# EAGLE design youth (EAGLE 4.16)
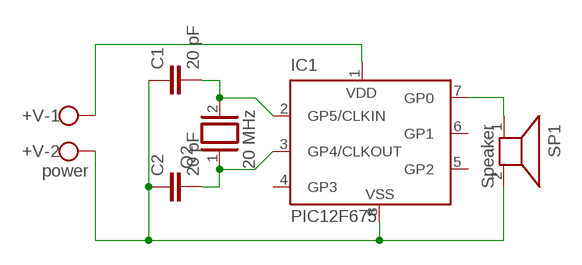
[diagram p0: schematic, sheet 1]

## Parts
+V  power  W237-102  [W237-102]
C1  20 pF  C7.5/3  [C7.5B3]
C2  20 pF  C7.5/3  [C7.5B3]
IC1  PIC12F675  PIC12F675P  [DIL8]
Q2  20 MHz  XTAL/S  [QS]
SP1  Speaker  AL201P  [AL201P]

## Nets
N$1: C1.2 IC1.2(GP5/CLKIN) Q2.2
N$2: C2.2 IC1.3(GP4/CLKOUT) Q2.1
N$3: +V.1 IC1.1(VDD)
N$5: IC1.7(GP0) SP1.1
N$6: +V.2 C1.1 C2.1 IC1.8(VSS) SP1.2
Unconnected: IC1.4(GP3) IC1.5(GP2) IC1.6(GP1)

## Library data of the parts
+V = bert:W237-102: WAGO SCREW CLAMP
C1 C2 = capacitor-wima:C: CAPACITOR naming: grid - package width
IC1 = microchip:PIC12F6*: Data Sheet 8-Pin FLASH-Based 8-Bit CMOS Microcontrollers Source: http://www.microchip.com .. 41190c.pdf
Q2 = special:XTAL/S: CRYSTAL
SP1 = buzzer:AL201P: SPEAKER Source: Buerklin

## Board
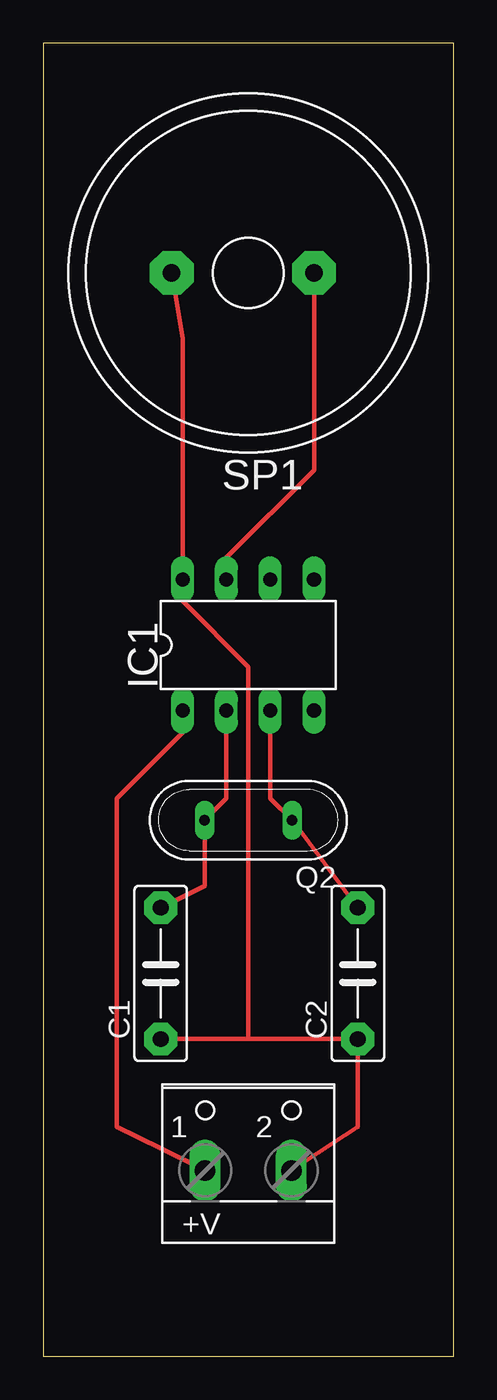
[diagram p1: board, top side]

Size 23.8 x 76.19 mm. Coordinates in mm from the lower left corner, seen from the top.
Outline: 0,0 23.8,0 23.8,76.19 0,76.19 0,0
Copper layers (1*16): Top 0.035mm / dielectric 1.5mm / Bottom 0.035mm
Design rules "default": minimum track width 10mil, minimum drill 24mil, track to track 8mil, track to pad 8mil, pad to pad 8mil, via to via 8mil, smd to smd 8mil, copper to edge 40mil, drill to drill 8mil, minimum pad ring 10mil, minimum via ring 8mil, stop-mask expansion 4mil, vias tented up to drill 0mil, thermal gap 10mil

### Footprints (pad centres in the part's own frame; a part is rotated, then mirrored left to right if it is on the bottom)
W237-102 = drill 1.194 long: 1 -2.5,-1.27; 2 2.5,-1.27
C7.5B3 = drill 0.914 pad 1.905 octagon: 1 -3.81,0; 2 3.81,0
DIL8 = drill 0.813 long: 1 -3.81,-3.81; 2 -1.27,-3.81; 3 1.27,-3.81; 4 3.81,-3.81; 5 3.81,3.81; 6 1.27,3.81; 7 -1.27,3.81; 8 -3.81,3.81
QS = drill 0.61 long: 1 -2.54,0; 2 2.54,0
AL201P = drill 1.016 pad 2.54 octagon: 1 -3.81,0; 2 4.445,0

### Placement (x,y rotation side)
+V  11.9,12.06 0 top
C1  6.82,22.22 90 top
C2  18.25,22.22 90 top
IC1  11.9,41.27 0 top
Q2  11.9,31.11 180 top
SP1  11.9,62.86 180 top

### Tracks (layer width: path | path; a pad name or v marks a point on that pad's centre or on a via)
N$1
  Top 0.254: IC1.2 10.63,32.38 Q2.2 9.36,27.3 C1.2
N$2
  Top 0.254: IC1.3 13.17,32.38 Q2.1 C2.2
N$3
  Top 0.254: IC1.1 8.09,36.19 4.28,32.38 4.28,13.33 6.82,12.06 +V.1
N$5
  Top 0.254: SP1.1 15.71,51.43 10.63,46.35 IC1.7
N$6
  Top 0.254: SP1.2 8.09,59.05 IC1.8 8.09,43.81 11.9,40 11.9,18.41 | +V.2 18.25,13.33 C2.1 11.9,18.41 | 11.9,18.41 C1.1